# EAGLE design PCB_Node (EAGLE 6.5.0)
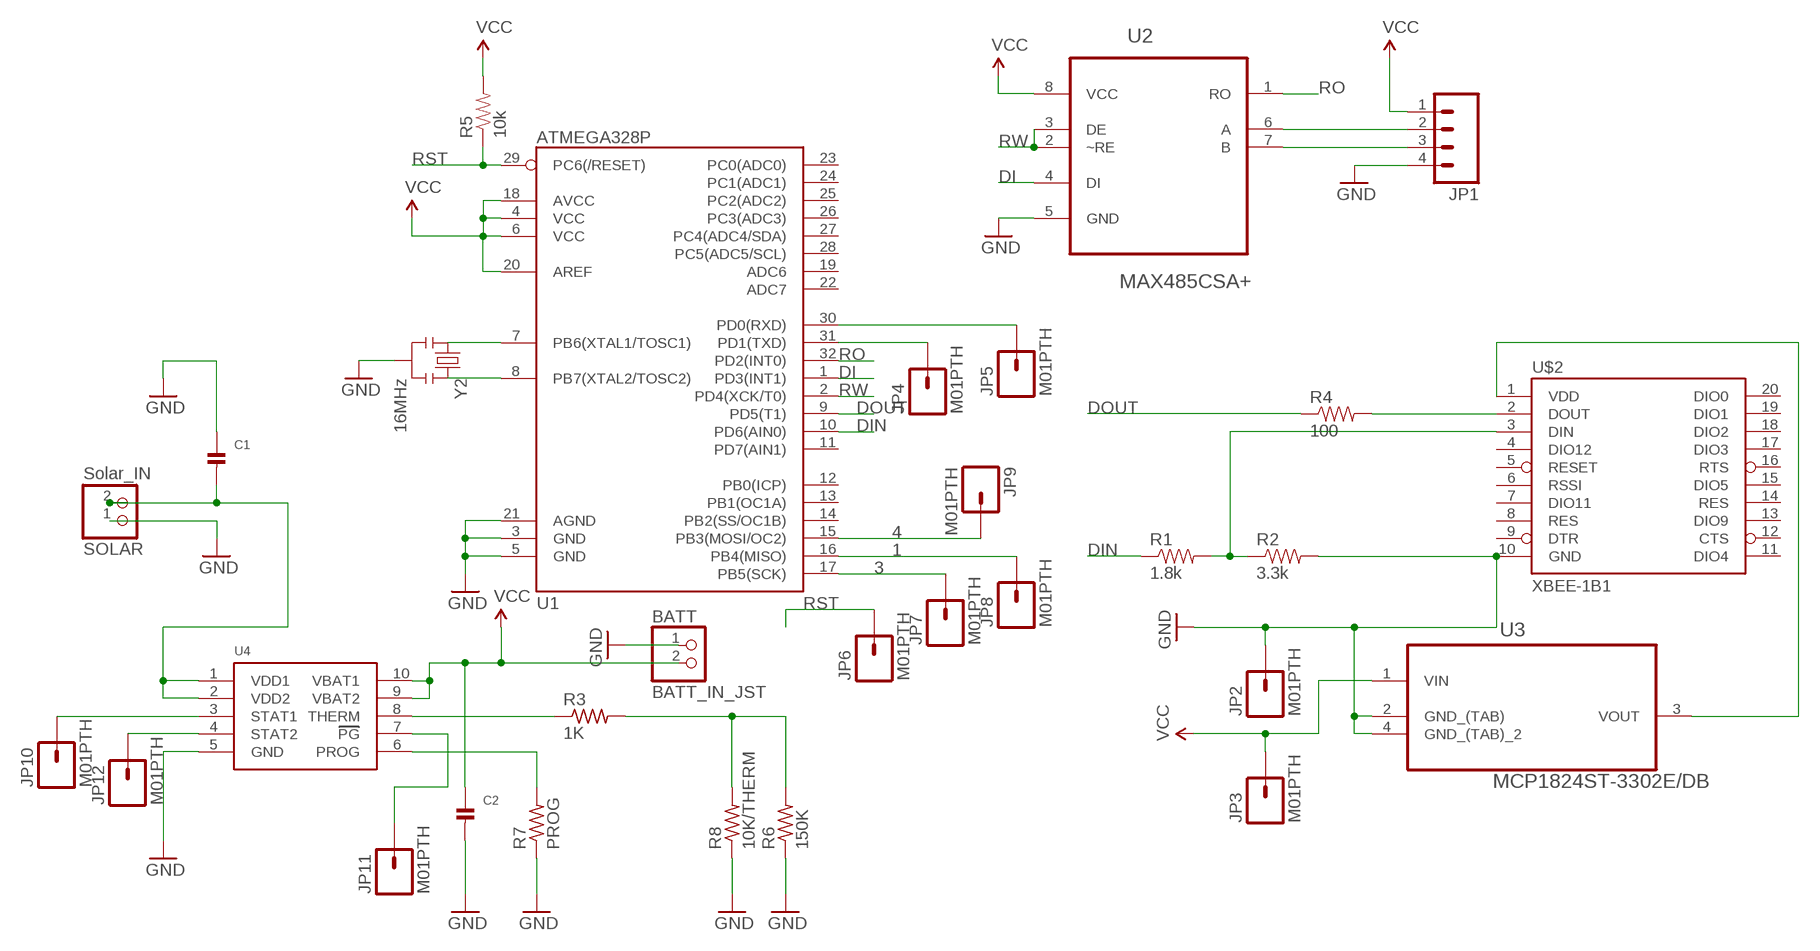
[diagram p0: schematic, sheet 1]

## Parts
BATT  BATT_IN_JST  JST_2PIN  [JSTPH2]
C1  CAP_CERAMIC0805  [0805]
C2  CAP_CERAMIC0805  [0805]
JP1  M04PTH  [1X04]
JP2  M01PTH  [1X01]
JP3  M01PTH  [1X01]
JP4  M01PTH  [1X01]
JP5  M01PTH  [1X01]
JP6  M01PTH  [1X01]
JP7  M01PTH  [1X01]
JP8  M01PTH  [1X01]
JP9  M01PTH  [1X01]
JP10  M01PTH  [1X01]
JP11  M01PTH  [1X01]
JP12  M01PTH  [1X01]
R1  1.8k  1.8KOHM1/10W1%(0603)  [0603-RES]
R2  3.3k  3.3KOHM1/10W1%(0603)  [0603-RES]
R3  1K  R-US_R0805  [R0805]
R4  100  100OHM1/10W1%(0603)  [0603-RES]
R5  10k  10K-1%RES-00824  [0603-RES]
R6  150K  R-US_R0805  [R0805]
R7  PROG  RESISTOR_DUAL  [0805-THM]
R8  10K/THERM  R-US_FLIPFLOP  [0805-THM]
SOLAR  Solar_IN  JST_2PIN  [JSTPH2]
U1  ATMEGA328P  ATMEGA328_SMT  [TQFP32-08]
U2  MAX485CSA+  [SOIC127P600X175-8N]
U3  MCP1824ST-3302E/DB  [SOT230P700X180-4N]
U4  MCP73833  [MSOP10]
U$2  XBEE-1B1  [XBEE-1]
Y2  16MHz  RESONATOR16MHZ  [RESONATOR-SMD]

## Nets
1: JP8.1 U1.16(PB4(MISO))
3: JP7.1 U1.17(PB5(SCK))
4: JP9.1 U1.15(PB3(MOSI/OC2))
DI: U1.1(PD3(INT1)) U2.4(DI)
DIN: R1.1 U1.10(PD6(AIN0))
DOUT: R4.1 U1.9(PD5(T1))
GND: BATT.1 C1.1 C2.2 JP1.4 JP2.1 R2.2 R6.1 R7.1 R8.1 SOLAR.1 U1.3(GND) U1.5(GND) U1.21(AGND) U2.5(GND) U3.2(GND_(TAB)) U3.4(GND_(TAB)_2) U4.5(GND) U$2.10(GND) Y2.2
N$1: R4.2 U$2.2(DOUT)
N$2: R1.2 R2.1 U$2.3(DIN)
N$3: R7.2 U4.6(PROG)
N$4: U3.3(VOUT) U$2.1(VDD)
N$5: R3.1 U4.8(THERM)
N$7: R3.2 R6.2 R8.2
N$8: C1.2 SOLAR.2 U4.1(VDD1) U4.2(VDD2)
N$9: JP10.1 U4.3(STAT1)
N$10: JP12.1 U4.4(STAT2)
N$11: JP11.1 U4.7(PG)
N$12: U1.8(PB7(XTAL2/TOSC2)) Y2.3
N$13: U1.7(PB6(XTAL1/TOSC1)) Y2.1
N$15: JP4.1 U1.31(PD1(TXD))
N$16: JP5.1 U1.30(PD0(RXD))
N$23: JP1.2 U2.6(A)
N$24: JP1.3 U2.7(B)
RO: U1.32(PD2(INT0)) U2.1(RO)
RST: JP6.1 R5.1 U1.29(PC6(/RESET))
RW: U1.2(PD4(XCK/T0)) U2.2(~RE) U2.3(DE)
VCC: BATT.2 C2.1 JP1.1 JP3.1 R5.2 U1.4(VCC) U1.6(VCC) U1.18(AVCC) U1.20(AREF) U2.8(VCC) U3.1(VIN) U4.9(VBAT2) U4.10(VBAT1)
Unconnected: U1.11(PD7(AIN1)) U1.12(PB0(ICP)) U1.13(PB1(OC1A)) U1.14(PB2(SS/OC1B)) U1.19(ADC6) U1.22(ADC7) U1.23(PC0(ADC0)) U1.24(PC1(ADC1)) U1.25(PC2(ADC2)) U1.26(PC3(ADC3)) U1.27(PC4(ADC4/SDA)) U1.28(PC5(ADC5/SCL)) U$2.4(DIO12) U$2.5(RESET) U$2.6(RSSI) U$2.7(DIO11) U$2.8(RES) U$2.9(DTR) U$2.11(DIO4) U$2.12(CTS) U$2.13(DIO9) U$2.14(RES) U$2.15(DIO5) U$2.16(RTS) U$2.17(DIO3) U$2.18(DIO2) U$2.19(DIO1) U$2.20(DIO0)

## Library data of the parts
BATT SOLAR = microbuilder:JST_2PIN: JST 2-Pin Right-Angle Connector PH-Series - 4UConnector: 17311 SH-Series - 4UConnector: 07278
C1 C2 = microbuilder:CAP_CERAMIC: Ceramic Capacitors 0402 - 0402 Surface Mount Capacitors 16pF 50V 5% [Digikey: 445-4899-2-ND] 18pF 50V 5% [Digikey: 490-1281-2-ND] 22pF 50V 5% [Digikey: 490-1283-2-ND] 68pF 50V 5% [Digikey: 490-1289-2-ND] 0.1uF 10V 10% [Digikey: 490-1318-2-ND] 1.0uF 6.3V 10% [Digikey: 490-1320-2-ND] 0603 - 0603 Surface Mount Capacitors 16 pF 50V 5% [Digikey: 445-5051-2-ND] 22 pF 50V [Digikey: PCC220ACVTR-ND] 33 pF 50V 5% [Digikey: 490-1415-1-ND] 56pF 50V 5% [Digikey: 490-1421-1-ND] 220pF 50V 5% [Digikey: 445-1285-1-ND] 680 pF 50V 2200 pF 50V 5% C0G [Digikey: 445-1297-1-ND] 5600 pF 100V 5% X7R [Digikey: 478-3711-1-ND] 0.1 µF 25V 10% [Digikey: PCC2277TR-ND] 0.22 µF 16V 10% X7R [Digikey: 445-1318-1-ND] 1.0 µF 25V 10% [Digikey: 445-5146-2-ND] 0603 - RF Specific 3pF 250V +/-0.1pF RF [Digikey: 712-1347-1-ND] 18 pF 250V 5% [Digikey: 478-3505-1-ND or 712-1322-1-ND] 56 pF 250V 5% C0G RF [Digikey: 490-4867-1-ND] 68 pF 250V RF [Digikey: 490-4868-1-ND] 0805 - 0805 Surface Mount Capacitors 220 pF 250V 2% RF Ceramic Capacitor [Digikey: 712-1398-1-ND] 1000 pF 50V 2% NP0 Ceramic Capacitor [Digikey: 478-3760-1-ND] 0.1 µF 25V 10% Ceramic Capacitor [Digikey: PCC1828TR-ND] 1.0 µF 16V 10% Ceramic Capacitor[Digikey: 490-1691-2-ND] 10.0 µF 10V 10% Ceramic Capacitor[Digikey: 709-1228-1-ND] 10.0 uF 16V 10% Ceramic Capacitor [Digikey: 478-5165-2-ND] 47 uF 6.3V 20% Ceramic Capacitor [Digikey: 587-1779-1-ND or 399-5506-1-ND] 1206 - 1206 Surface Mount Capacitors 47uF 10V 20% Ceramic Capacitor [Digikey: 490-5528-1-ND or 399-5508-1-ND or 445-6010-1-ND] 100uF 6.3V -20%, +80% Y5V Ceramic Capacitor (Digikey: 490-4512-1-ND, Mouser: 81-GRM31CF50J107ZE1L)
JP1 = SparkFun-Connectors:M04: Header 4 Standard 4-pin 0.1" header. Use with straight break away headers (SKU : PRT-00116), right angle break away headers (PRT-00553), swiss pins (PRT-00743), machine pins (PRT-00117), and female headers (PRT-00115). Molex polarized connector foot print use with SKU : PRT-08231 with associated crimp pins and housings. 1MM SMD Version SKU: PRT-10208
JP2-JP12 = SparkFun-Connectors:M01: Header 1 Standard 1-pin 0.1" header. Use with straight break away headers (SKU : PRT-00116), right angle break away headers (PRT-00553), swiss pins (PRT-00743), machine pins (PRT-00117), and female headers (PRT-00115).
R1 = SparkFun-Resistors:1.8KOHM1/10W1%(0603): RES-09119; PROD_ID: RES-09119
R2 = SparkFun-Resistors:3.3KOHM1/10W1%(0603): RES-07851; PROD_ID: RES-07851
R3 R6 R8 = adafruit:R-US_: RESISTOR, American symbol
R4 = SparkFun-Resistors:100OHM1/10W1%(0603): RES-07863; PROD_ID: RES-07863
R5 = SparkFun-Resistors:10K-1%: 10k-ohm SMT 1/10W - 1% (0603) RES-00824; PROD_ID: RES-00824
R7 = microbuilder:RESISTOR_DUAL: Flip Flop resistor An 0805 resistor inside a standard 1/4W 5% resistor. Makes for easy mods Footprint taken from the Adafruit Industries Eagle Library.
U1 = SparkFun-DigitalIC:ATMEGA328_SMT: 32-Pin Atmega328 part Commonly used on Arduino compatible boards Available in QFP and QFN packages TQFP is IC-09069 QFN is non-stock; PROD_ID: IC-09069
U2 = Maxim_By_element14_Batch_1:MAX485CSA+: ±15kV ESD-Protected, Slew-Rate-Limited, Low-Power, RS-485/RS-422 Transceivers; MPN: MAX485CSA+; OC_FARNELL: 9725954; OC_NEWARK: 68K4795; PACKAGE: SOIC-8; SUPPLIER: Maxim
U3 = Microchip_By_element14_Batch_1:MCP1824ST-3302E/DB: IC, LDO VOLT REG, 3.3V, 0.3A,; MPN: MCP1824ST-3302E/DB; OC_FARNELL: 1578379; OC_NEWARK: 05N1293; PACKAGE: SOT-223-3; SUPPLIER: Microchip
U4 = microbuilder:MCP73833: Lithium-Polymer/Lithium-Ion Battery Charger [Part No.] Microchip MCP73833 MSOP10 (tube only): Digikey: MCP73833T-AMI/UN or MCP73833-FCI/UN-ND Mouser: 579-MCP73833-AMI/UN DFN10 (tape): Digikey: Note Chips ending in 'AMI' have no timer, and chips ending in 'FCI' have a 6-hour timer that will end the charge sequence after 6 horus regqrdless of current charge level.
U$2 = SparkFun-RF:XBEE-1: Xbee module footprints SMT header is CONN-09042.
Y2 = SparkFun-FreqCtrl:RESONATOR: Resonator Small SMD resonator. Used, eg, on the Arduino Pro/ Pro Mini boards. 8MHz- XTAL-08895 16MHz- XTAL-08900; PROD_ID: XTAL-08900

## Board
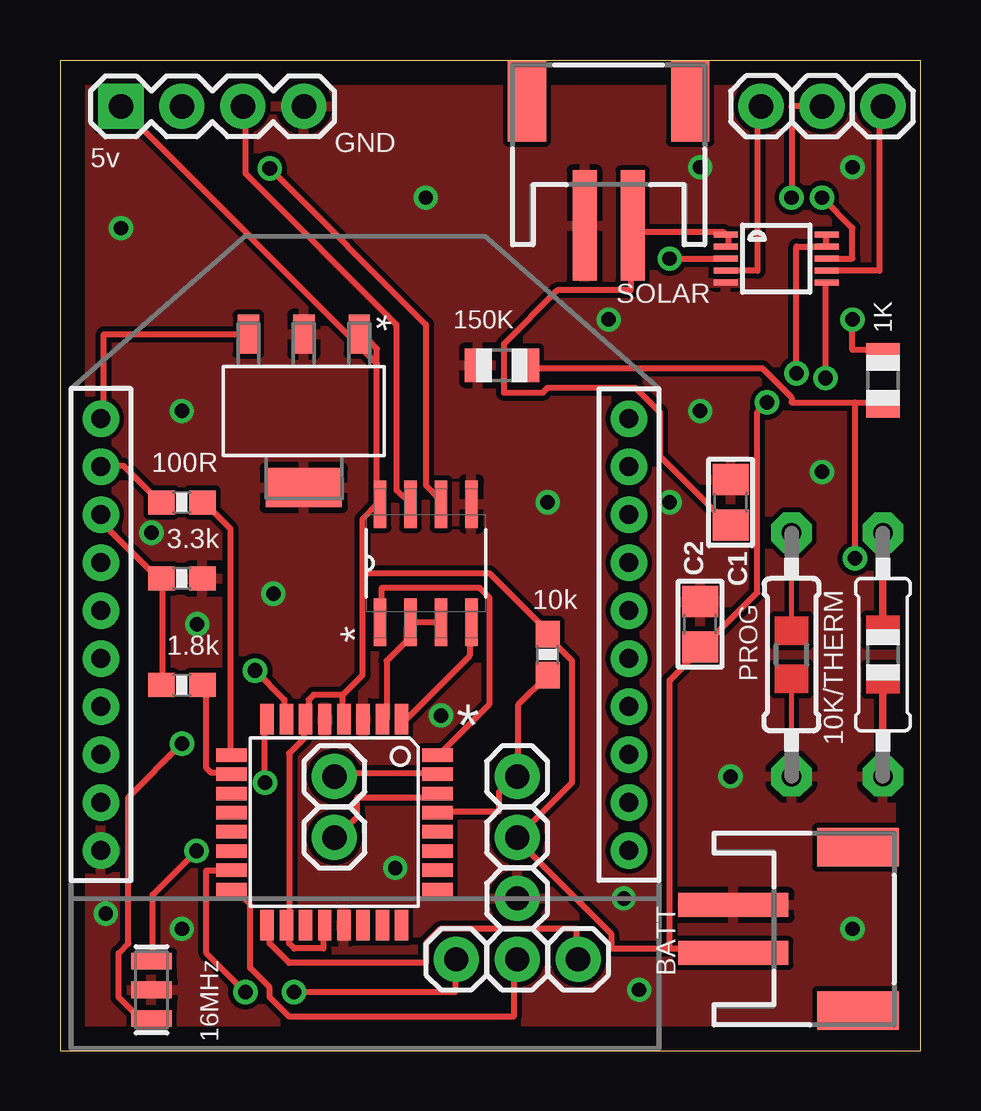
[diagram p1: board, top side]
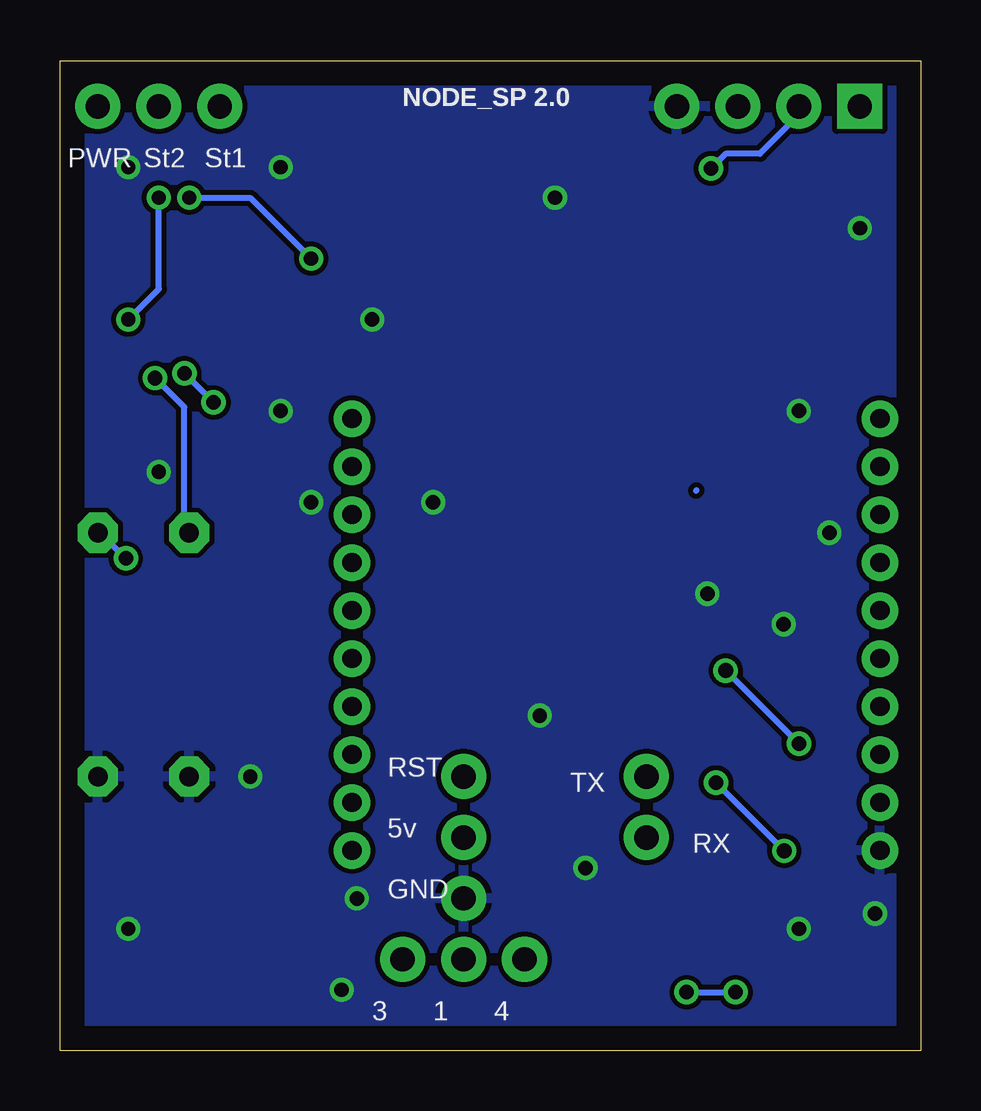
[diagram p2: board, bottom side, seen from below]

Size 35.87 x 41.27 mm. Coordinates in mm from the lower left corner, seen from the top.
Outline: 0,0 35.87,0 35.87,41.27 0,41.27 0,0
Copper layers (1*16): Top 0.035mm / dielectric 1.5mm / Bottom 0.035mm
Design rules "default": minimum track width 10mil, minimum drill 24mil, track to track 8mil, track to pad 8mil, pad to pad 8mil, via to via 8mil, smd to smd 8mil, copper to edge 40mil, drill to drill 8mil, minimum pad ring 10mil, minimum via ring 8mil, stop-mask expansion 4mil, vias tented up to drill 0mil, thermal gap 10mil

### Footprints (pad centres in the part's own frame; a part is rotated, then mirrored left to right if it is on the bottom)
JSTPH2 = smd 1 x 4.6: 1 -1,-3.7; 2 1,-3.7 | smd 1.6 x 3.4: NC1 -3.4,1.5; NC2 3.4,1.5
0805 = smd 1.3 x 1.5: 1 -0.95,0; 2 0.95,0
1X04 = drill 1.016 pad 1.88 square: 1 0,0 | drill 1.016 pad 1.88: 2 2.54,0; 3 5.08,0; 4 7.62,0
1X01 = drill 1.016 pad 1.88: 1 0,0
0603-RES = smd 1.1 x 1: 1 -0.85,0; 2 0.85,0
R0805 = smd 1.1 x 1.4: 1 -1,0; 2 1,0
0805-THM = drill 0.813 pad 1.676 octagon: 1 -5.08,0; 2 5.08,0
TQFP32-08 = smd 1.27 x 0.559: 1 -4.293,2.8; 2 -4.293,2; 3 -4.293,1.2; 4 -4.293,0.4; 5 -4.293,-0.4; 6 -4.293,-1.2; 7 -4.293,-2; 8 -4.293,-2.8; 17 4.293,-2.8; 18 4.293,-2; 19 4.293,-1.2; 20 4.293,-0.4; 21 4.293,0.4; 22 4.293,1.2; 23 4.293,2; 24 4.293,2.8 | smd 0.559 x 1.27: 9 -2.8,-4.293; 10 -2,-4.293; 11 -1.2,-4.293; 12 -0.4,-4.293; 13 0.4,-4.293; 14 1.2,-4.293; 15 2,-4.293; 16 2.8,-4.293; 25 2.8,4.293; 26 2,4.293; 27 1.2,4.293; 28 0.4,4.293; 29 -0.4,4.293; 30 -1.2,4.293; 31 -2,4.293; 32 -2.8,4.293
SOIC127P600X175-8N = smd 1.981 x 0.533: 1 -2.464,1.905; 2 -2.464,0.635; 3 -2.464,-0.635; 4 -2.464,-1.905; 5 2.464,-1.905; 6 2.464,-0.635; 7 2.464,0.635; 8 2.464,1.905
SOT230P700X180-4N = smd 1.626 x 0.889: 1 -3.2,2.311; 2 -3.2,0; 3 -3.2,-2.311 | smd 1.626 x 3.175: 4 3.2,0
MSOP10 = smd 0.25 x 1: 1 -1,-2.113; 2 -0.5,-2.113; 3 0,-2.113; 4 0.5,-2.113; 5 1,-2.113; 6 1,2.113; 7 0.5,2.113; 8 0,2.113; 9 -0.5,2.113; 10 -1,2.113
XBEE-1 = drill 0.8 pad 1.524: 1 -11,20; 2 -11,18; 3 -11,16; 4 -11,14; 5 -11,12; 6 -11,10; 7 -11,8; 8 -11,6; 9 -11,4; 10 -11,2; 11 11,2; 12 11,4; 13 11,6; 14 11,8; 15 11,10; 16 11,12; 17 11,14; 18 11,16; 19 11,18; 20 11,20
RESONATOR-SMD = smd 0.7 x 1.7: 1 -1.2,0; 2 0,0; 3 1.2,0

### Placement (x,y rotation side)
BATT  31.75,5.08 270 top
C1  27.94,22.86 270 top
C2  26.67,17.78 90 top
JP1  2.54,39.37 0 top
JP2  19.05,6.35 0 top
JP3  19.05,8.89 0 top
JP4  11.43,11.43 0 top
JP5  11.43,8.89 0 top
JP6  19.05,11.43 0 top
JP7  21.59,3.81 0 top
JP8  19.05,3.81 0 top
JP9  16.51,3.81 0 top
JP10  31.75,39.37 0 top
JP11  34.29,39.37 0 top
JP12  29.21,39.37 0 top
R1  5.08,15.24 180 top
R2  5.08,19.68 0 top
R3  34.29,27.94 270 top
R4  5.08,22.86 180 top
R5  20.32,16.51 90 top
R6  18.41,28.57 0 top
R7  30.48,16.51 90 top
R8  34.29,16.51 90 top
SOLAR  22.86,38.1 0 top
U1  11.43,9.53 270 top
U2  15.24,20.32 90 top
U3  10.16,26.67 270 top
U4  29.84,33.02 270 top
U$2  12.7,6.35 0 top
Y2  3.81,2.54 90 top

### Tracks (layer width: path | path; a pad name or v marks a point on that pad's centre or on a via)
1
  Top 0.254: U1.16 7.32,6.71 7.92,6.1 7.92,3.45 8.74,2.64 8.74,2.23 9.55,1.42 18.9,1.42 18.9,3.66 JP8.1
3
  Top 0.254: U1.17 8.74,5.08 8.74,4.47 9.55,3.66 15.24,3.66 15.24,4.47 15.85,5.08 21.54,5.08 21.54,3.86 JP7.1
4  (via drill 0.61)
  Top 0.254: v7.72,2.44 6.1,4.06 6.1,7.52 7.11,7.52 U1.15 | v9.75,2.44 16.46,2.44 16.46,3.66 JP9.1
  Bottom 0.254: v9.75,2.44 v7.72,2.44
DI
  Top 0.254: U1.1 14.43,13.82 17.07,16.46 17.07,17.68 U2.4
DIN
  Top 0.254: R1.1 6.1,15.24 6.1,11.79 6.3,11.58 7.11,11.58 U1.10
DOUT
  Top 0.254: R4.1 6.1,22.76 7.11,21.74 7.11,12.39 U1.9
GND  (via drill 0.6)
  other vias: 1.91,5.71 5.08,5.08 13.97,7.62 24.13,2.54 33.02,5.08 27.94,11.43 23.5,6.35 15.88,13.97 8.89,19.05 5.71,17.78 3.81,21.59 20.32,22.86 31.75,24.13 5.08,26.67 2.54,34.29 15.24,35.56 22.86,30.48 26.67,36.83 33.02,36.83 26.67,26.67 25.4,22.86
  pour Top: -2.54,43.18 38.1,43.18 38.1,-2.54 -2.54,-2.54
  pour Bottom: -2.54,43.18 38.1,43.18 38.1,-2.54 -2.54,-2.54
N$1
  Top 0.254: R4.2 4.06,22.96 2.64,24.38 1.83,24.38 U$2.2
N$2
  Top 0.254: R1.2 4.27,15.24 4.27,19.51 R2.1 4.06,19.71 1.83,21.95 1.83,22.15 U$2.3
N$3  (via drill 0.61)
  Top 0.254: v31.9,28.04 31.9,31.9 U4.6
  Bottom 0.254: v31.9,28.04 30.68,26.82 30.68,21.74 30.48,21.74 R7.2
N$4
  Top 0.254: U3.3 1.83,29.87 1.83,26.42 U$2.1
N$5  (via drill 0.6)
  Top 0.254: v31.75,35.56 33.02,34.29 33.02,33.02 U4.8 | v33.02,30.48 33.02,29.21 34.29,29.21 R3.1
  Bottom 0.254: v31.75,35.56 31.75,31.75 v33.02,30.48
N$6
  Bottom 0.254: 9.35,23.37 9.36,23.34
N$7  (via drill 0.61)
  Top 0.254: 33.12,27.03 30.48,27.03 30.48,27.23 29.26,28.45 19.51,28.45 R6.2 | 33.12,27.03 34.14,27.03 R3.2 | 33.12,27.03 v33.12,20.52
  Bottom 0.254: v33.12,20.52 34.14,21.54 R8.2
N$8
  Top 0.254: U4.2 27.84,33.53 27.84,33.93 U4.1 27.64,34.14 23.98,34.14 23.98,34.34 SOLAR.2 23.77,34.34 23.77,31.7 20.73,31.7 18.49,29.46 18.49,27.43 20.12,27.43 20.32,27.64 23.98,27.64 24.99,26.62 24.99,24.79 27.84,21.95 C1.2
N$9  (via drill 0.6)
  Top 0.254: v25.4,33.02 U4.3 | v30.48,35.56 30.48,39.37 JP10.1
  Bottom 0.254: v25.4,33.02 27.94,35.56 v30.48,35.56
N$10
  Top 0.254: U4.4 27.84,32.51 29.06,32.51 29.06,39.22 JP12.1
N$11
  Top 0.254: U4.7 32.11,32.51 34.14,32.51 34.14,39.22 JP11.1
N$12  (via drill 0.61)
  Top 0.254: v8.53,11.18 8.53,13.82 U1.8 | v5.69,8.33 3.86,6.5 3.86,3.86 Y2.3
  Bottom 0.254: v5.69,8.33 v8.53,11.18
N$13  (via drill 0.61)
  Top 0.254: v8.13,15.85 9.35,14.63 9.35,13.82 U1.7 | v5.08,12.8 2.85,10.57 2.85,4.47 2.44,4.06 2.44,2.23 3.25,1.42 3.66,1.42 Y2.1
  Bottom 0.254: v5.08,12.8 v8.13,15.85
N$15
  Top 0.254: U1.31 15.65,11.58 11.58,11.58 JP4.1
N$16
  Top 0.254: U1.30 15.65,10.57 12.39,10.57 12.39,9.75 11.58,8.94 JP5.1
N$23  (via drill 0.61)
  Top 0.254: v8.74,36.78 15.24,30.28 15.24,23.57 15.85,22.96 U2.6
  Bottom 0.254: v8.74,36.78 8.13,37.39 6.71,37.39 5.08,39.01 JP1.2
N$24
  Top 0.254: U2.7 14.02,23.37 14.02,30.28 7.72,36.58 7.72,39.22 JP1.3
RO
  Top 0.254: U1.32 15.85,12.39 17.88,14.43 17.88,18.9 17.48,19.3 13.41,19.3 13.41,17.88 U2.1
RST
  Top 0.254: R5.1 20.32,15.65 19.1,14.43 19.1,11.58 JP6.1 18.9,11.38 18.29,10.77 18.29,9.96 15.85,9.96 U1.29
RW
  Top 0.254: U1.2 13.61,13.82 13.61,16.26 14.43,17.07 14.43,17.68 U2.2 14.63,17.88 15.85,17.88 U2.3
VCC  (via drill 0.61)
  Top 0.254: 31.9,33.53 31.9,33.93 U4.10 | 31.9,33.53 30.68,33.53 v30.68,28.25 | v29.46,27.03 29.06,26.62 29.06,19.1 26.82,16.87 C2.1 26.62,16.66 25.4,15.44 25.4,4.27 | 31.9,33.53 U4.9 | 25.4,4.27 22.96,4.27 22.96,4.88 19.1,8.74 JP3.1 21.34,11.18 21.34,16.26 20.32,17.27 R5.2 20.32,17.48 17.88,19.91 12.6,19.91 | 25.4,4.27 28.04,4.27 BATT.2 | U1.20 10.97,5.08 10.97,4.27 9.75,4.27 9.55,4.47 9.55,5.08 U1.18 9.55,5.28 9.55,12.39 10.16,13.01 10.16,13.82 U1.6 10.36,13.82 10.36,14.63 10.57,14.83 11.79,14.83 | 11.79,14.83 11.79,13.82 U1.4 | 13.21,28.65 13.21,22.96 U2.8 13.21,22.76 12.6,22.15 12.6,19.91 | 13.21,28.65 13.21,29.26 12.6,29.87 U3.1 | 13.21,28.65 2.64,39.22 JP1.1 | 11.79,14.83 12.6,15.65 12.6,19.91
  Bottom 0.254: v29.46,27.03 v30.68,28.25

### Text on the board
tNames: 5v | GND | 100R | 3.3k | 10k | 1.8k | *
bNames: NODE_SP 2.0 | St1 | St2 | PWR | TX | RST | 5v | RX | GND | 4 | 1 | 3